# Altium schematic sheet Microcontroller.SchDoc
size A3; SheetNumber: 1; SheetTotal: 2
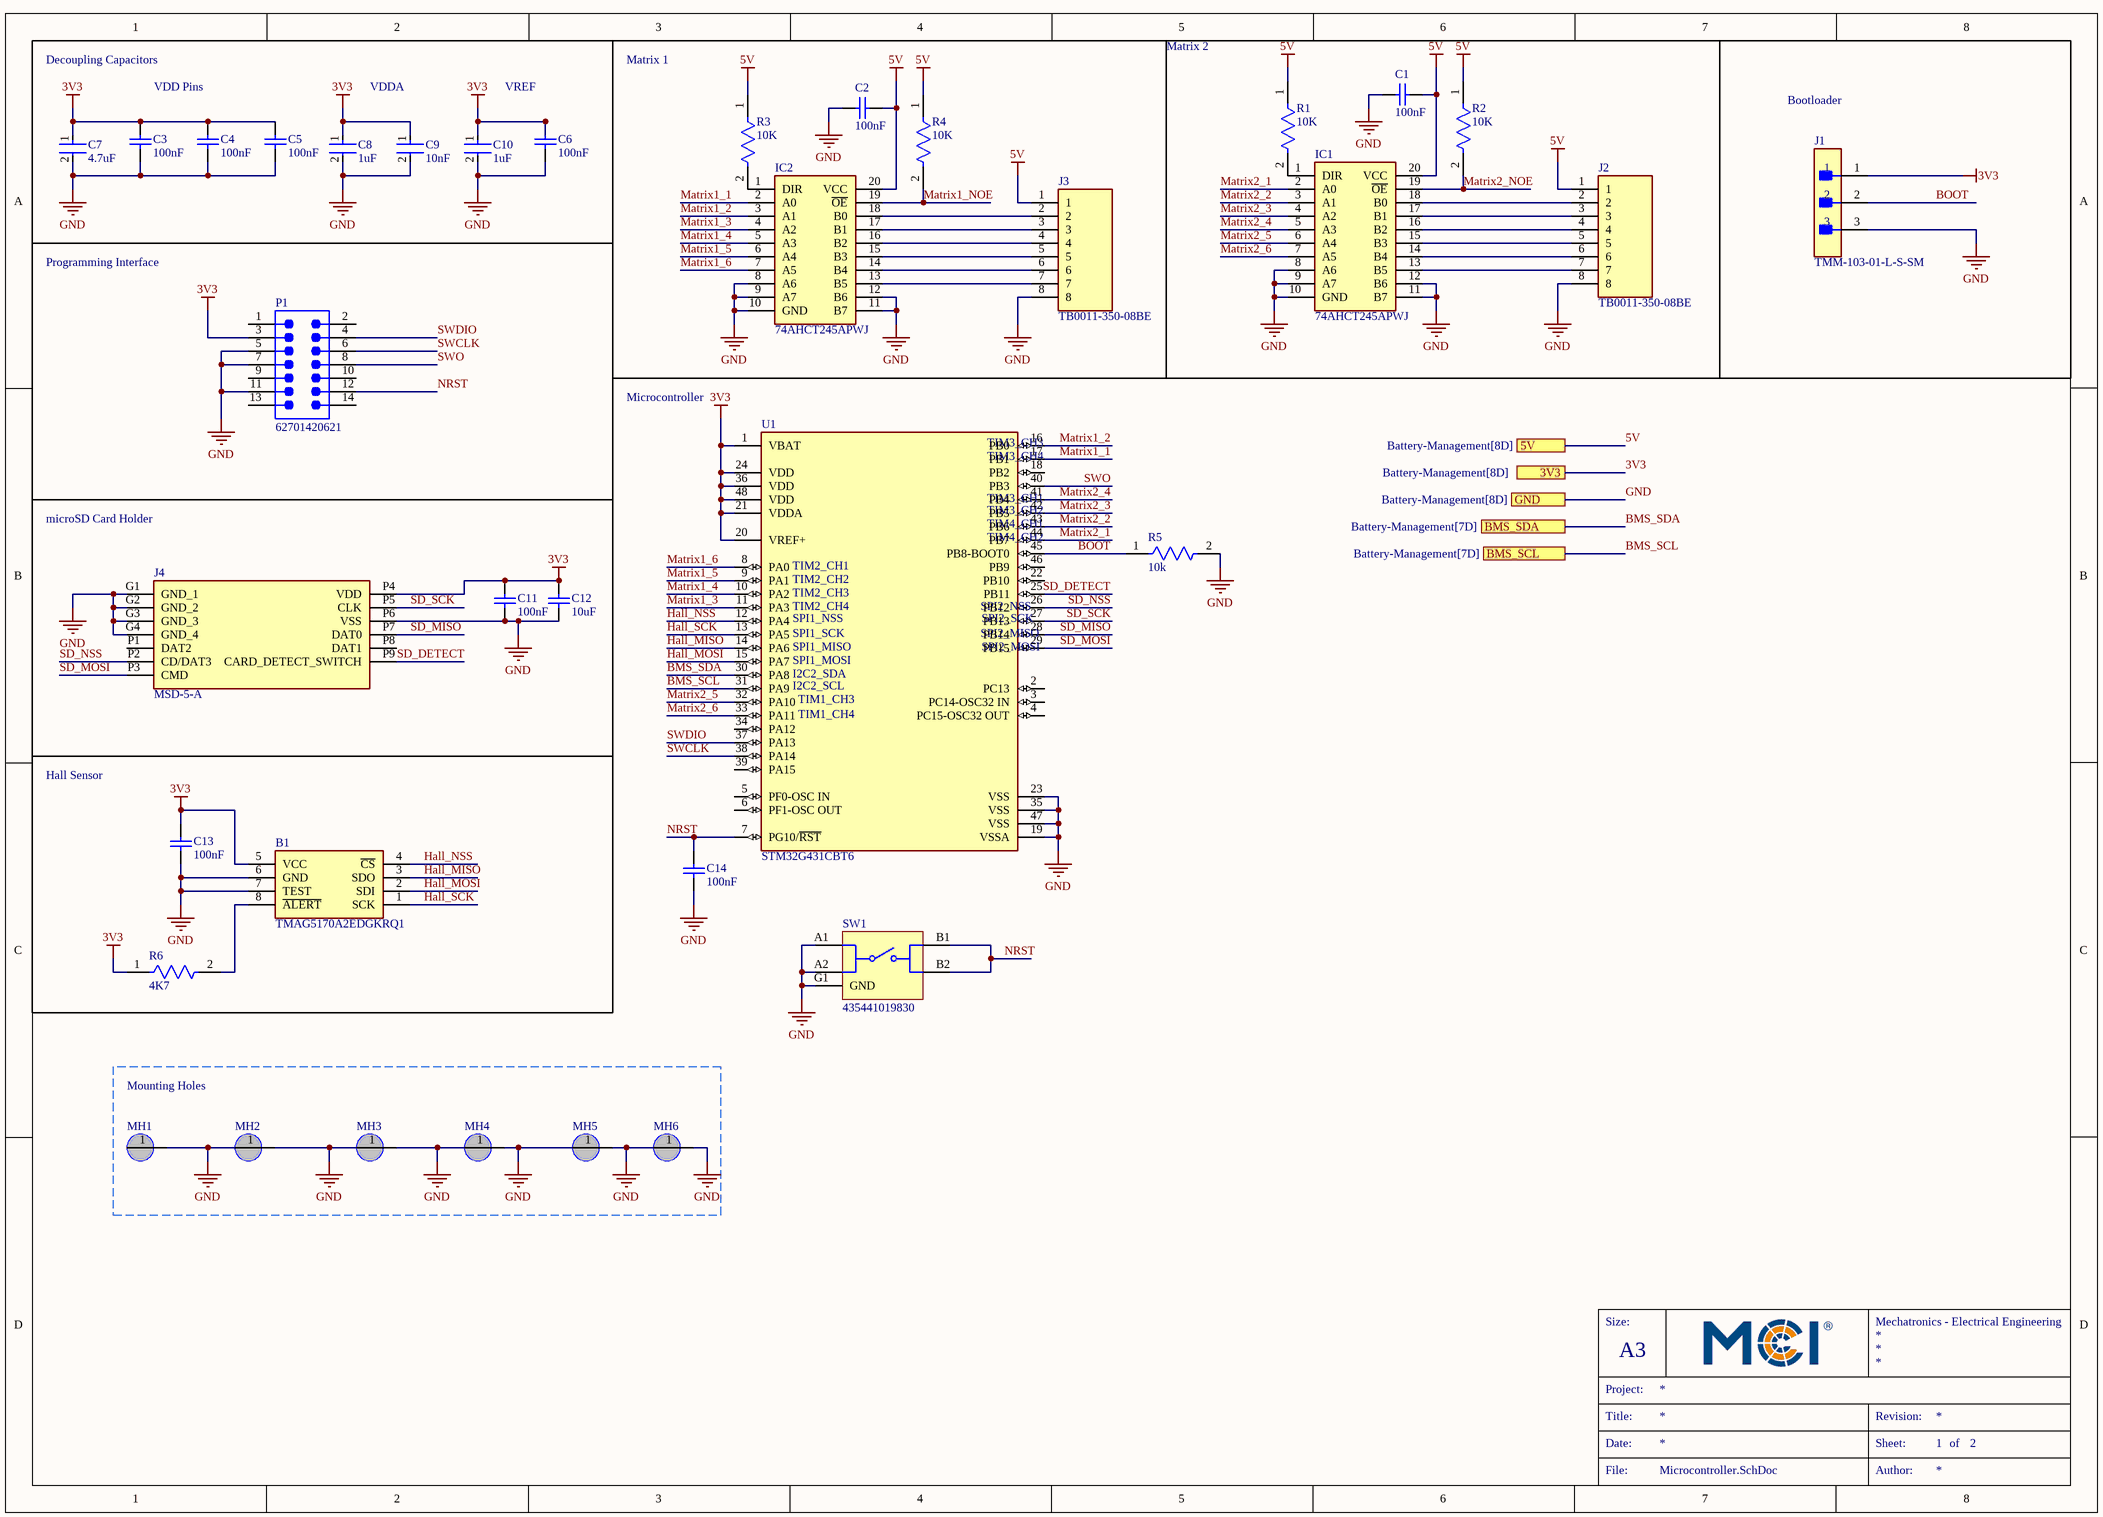
[diagram p0: Microcontroller.SchDoc]

## Parts
B1  TMAG5170A2EDGKRQ1  [SOP65P490X110-8N]
C1  100nF  [CAPC2013X145X50LL20T20]
C2  100nF  [CAPC2013X145X50LL20T20]
C3  100nF  [CAPC2013X145X50LL20T20]
C4  100nF  [CAPC2013X145X50LL20T20]
C5  100nF  [CAPC2013X145X50LL20T20]
C6  100nF  [CAPC2013X145X50LL20T20]
C7  4.7uF  [FP-C0805C475K3RACAUTO-MFG]
C8  1uF  [FP-CC0805-EB-MFG]
C9  10nF  [FP-AC0805-0_85-MFG]
C10  1uF  [FP-CC0805-EB-MFG]
C11  100nF  [CAPC2013X145X50LL20T20]
C12  10uF  [CAPC2013X140X50ML20T25]
C13  100nF  [CAPC2013X145X50LL20T20]
C14  100nF  [CAPC2013X145X50LL20T20]
IC1  74AHCT245APWJ  [SOP65P640X110-20N]
IC2  74AHCT245APWJ  [SOP65P640X110-20N]
J1  TMM-103-01-L-S-SM  [FP-TMM-103-01-L-S-SM-MFG]
J2  TB0011-350-08BE  [TB0011-350-08BE]
J3  TB0011-350-08BE  [TB0011-350-08BE]
J4  MSD-5-A  [MSD5A]
MH1  MountingHole  [MTH]  (value not drawn)
MH2  MountingHole  [MTH]  (value not drawn)
MH3  MountingHole  [MTH]  (value not drawn)
MH4  MountingHole  [MTH]  (value not drawn)
MH5  MountingHole  [MTH]  (value not drawn)
MH6  MountingHole  [MTH]  (value not drawn)
P1  62701420621  [62701420621]
R1  10K  [FP-AT0805-MFG]
R2  10K  [FP-AT0805-MFG]
R3  10K  [FP-AT0805-MFG]
R4  10K  [FP-AT0805-MFG]
R5  10k  [FP-AT0805-MFG]
R6  4K7  [FP-RT0805-MFG]
SW1  435441019830  [435441019830]
U1  STM32G431CBT6  [FP-LQFP48-5B-MFG]

## Blocks framed on the sheet
Matrix 1: C2 IC2 J3 R3 R4
Matrix 2: C1 IC1 J2 R1 R2
Mounting Holes: MH1-MH6

## Ports
3V3 (see Battery-Management[8D]), 5V (see Battery-Management[8D]), BMS_SCL (see Battery-Management[7D]), BMS_SDA (see Battery-Management[7D]), GND (see Battery-Management[8D])

## Nets
3V3: B1.5(VCC) C3.2 C4.2 C5.2 C6.2 C7.1 C8.1 C9.1 C10.1 C11.1 C12.2 C13.2 J1.1 J4.P4(VDD) P1.3 R6.1 U1.1(VBAT) U1.20(VREF+) U1.21(VDDA) U1.24(VDD) U1.36(VDD) U1.48(VDD) ; port 3V3
5V: C1.2 C2.2 IC1.20(VCC) IC2.20(VCC) J2.1 J3.1 R1.1 R2.1 R3.1 R4.1 ; port 5V
GND: B1.6(GND) B1.7(TEST) C1.1 C2.1 C3.1 C4.1 C5.1 C6.1 C7.2 C8.2 C9.2 C10.2 C11.2 C12.1 C13.1 C14.1 IC1.8(A6) IC1.9(A7) IC1.10(GND) IC1.11(B7) IC1.12(B6) IC2.8(A6) IC2.9(A7) IC2.10(GND) IC2.11(B7) IC2.12(B6) J1.3 J2.8 J3.8 J4.G1(GND_1) J4.G2(GND_2) J4.G3(GND_3) J4.G4(GND_4) J4.P6(VSS) MH1.1 MH2.1 MH3.1 MH4.1 MH5.1 MH6.1 P1.5 P1.7 P1.11 R5.2 SW1.A1 SW1.A2 SW1.G1(GND) U1.19(VSSA) U1.23(VSS) U1.35(VSS) U1.47(VSS) ; port GND
BMS_SCL: U1.31(PA9) ; port BMS_SCL
BMS_SDA: U1.30(PA8) ; port BMS_SDA
BOOT: J1.2 R5.1 U1.45(PB8-BOOT0)
Hall_MISO: B1.3(SDO) U1.14(PA6)
Hall_MOSI: B1.2(SDI) U1.15(PA7)
Hall_NSS: B1.4(~{CS}) U1.12(PA4)
Hall_SCK: B1.1(SCK) U1.13(PA5)
Matrix1_1: IC2.2(A0) U1.17(PB1)
Matrix1_2: IC2.3(A1) U1.16(PB0)
Matrix1_3: IC2.4(A2) U1.11(PA3)
Matrix1_4: IC2.5(A3) U1.10(PA2)
Matrix1_5: IC2.6(A4) U1.9(PA1)
Matrix1_6: IC2.7(A5) U1.8(PA0)
Matrix1_NOE: IC2.19(~{OE}) R4.2
Matrix2_1: IC1.2(A0) U1.44(PB7)
Matrix2_2: IC1.3(A1) U1.43(PB6)
Matrix2_3: IC1.4(A2) U1.42(PB5)
Matrix2_4: IC1.5(A3) U1.41(PB4)
Matrix2_5: IC1.6(A4) U1.32(PA10)
Matrix2_6: IC1.7(A5) U1.33(PA11)
Matrix2_NOE: IC1.19(~{OE}) R2.2
NRST: C14.2 P1.12 SW1.B1 SW1.B2 U1.7(PG10/~{RST})
SD_DETECT: J4.P9(CARD_DETECT_SWITCH) U1.25(PB11)
SD_MISO: J4.P7(DAT0) U1.28(PB14)
SD_MOSI: J4.P3(CMD) U1.29(PB15)
SD_NSS: J4.P2(CD/DAT3) U1.26(PB12)
SD_SCK: J4.P5(CLK) U1.27(PB13)
SWCLK: P1.6 U1.38(PA14)
SWDIO: P1.4 U1.37(PA13)
SWO: P1.8 U1.40(PB3)
NetB1_8: B1.8(~{ALERT}) R6.2
NetIC1_1: IC1.1(DIR) R1.2
NetIC1_13: IC1.13(B5) J2.7
NetIC1_14: IC1.14(B4) J2.6
NetIC1_15: IC1.15(B3) J2.5
NetIC1_16: IC1.16(B2) J2.4
NetIC1_17: IC1.17(B1) J2.3
NetIC1_18: IC1.18(B0) J2.2
NetIC2_1: IC2.1(DIR) R3.2
NetIC2_13: IC2.13(B5) J3.7
NetIC2_14: IC2.14(B4) J3.6
NetIC2_15: IC2.15(B3) J3.5
NetIC2_16: IC2.16(B2) J3.4
NetIC2_17: IC2.17(B1) J3.3
NetIC2_18: IC2.18(B0) J3.2

Not connected (* = marked no-connect by the designer): J4 P1(DAT2) P8(DAT1); P1 1 2 9 10 13 14; U1 2(PC13) 3(PC14-OSC32_IN) 4(PC15-OSC32_OUT) 5(PF0-OSC_IN) 6(PF1-OSC_OUT) 18(PB2) 22(PB10) 34(PA12) 39(PA15) 46(PB9)

## Notes on the sheet
- Decoupling Capacitors
- VDD Pins
- VDDA
- VREF
- Bootloader
- Programming Interface
- Microcontroller
- (near U1) TIM3_CH3
- (near U1) TIM3_CH4
- microSD Card Holder
- (near U1) TIM3_CH1
- (near U1) TIM3_CH2
- (near U1) TIM4_CH1
- (near U1) TIM2_CH3
- (near U1) TIM2_CH2
- (near U1) TIM2_CH1
- (near U1) TIM4_CH2
- (near U1) TIM2_CH4
- (near U1) SPI1_NSS
- (near U1) SPI1_SCK
- (near U1) SPI1_MISO
- (near U1) SPI2_NSS
- (near U1) SPI2_MISO
- (near U1) SPI2_SCK
- (near U1) SPI2_MOSI
- (near U1) SPI1_MOSI
- (near U1) I2C2_SDA
- (near U1) I2C2_SCL
- (near U1) TIM1_CH3
- (near U1) TIM1_CH4
- Hall Sensor
- Size:
- Mechatronics - Electrical Engineering
- Project:
- A3
- Title:
- Date:
- Revision:
- Sheet:
- of
- File:
- Author:

## Library data of the parts
B1 = TMAG5170A2EDGKRQ1: Board Mount Hall Effect/Magnetic Sensors; Manufacturer_Name: Texas Instruments; Geometry.Height: 1.1mm; Mouser Part Number: 595-MAG5170A2EDGKRQ1; Mouser Price/Stock: https://www.mouser.co.uk/ProductDetail/Texas-Instruments/TMAG5170A2EDGKRQ1?qs=doiCPypUmgFsK4QjDrwHCw%3D%3D; Manufacturer_Part_Number: TMAG5170A2EDGKRQ1; Datasheet Link: https://www.ti.com/lit/gpn/tmag5170-q1
C1-C6 C11 C13 C14 = CMP-2007-01396-1: Part Number: VJ0805Y104JXXPW1BC; Manufacturer: Vitramon
C7 = CMP-03020-034682-1: CAP CER 0805 4.7UF 25V X7R  10%; RoHS Compliant: Yes
C8 C10 = CMP-03422-000665-2: CAP CER 1UF 6.3V X7R 0805; Tolerance: 10%; Capacitance: 1uF; Weight: 0.000194oz; Width: 0.049inch; Thickness: 0.057inch; Dielectric: X7R; Termination: SMD/SMT; Packaging: Tape and Reel; RoHS Compliant: Yes; Length: 2mm; Halogen Free: Halogen Free; Voltage Rating: 6.3V; Height: 1.25mm; Max Operating Temperature: 125°C; Depth: 1.25mm; Construction: Flat; Case Code (Metric): 2012; Series: CC; Case/Package: 0805; Resistor Type: Ceramic; Case Code (Imperial): 0805; Min Operating Temperature: -55°C; Voltage Rating (DC): 6.3V; Lead Free: Lead Free; Mount: Surface Mount; Radiation Hardening: No
C9 = CMP-03422-000545-1: AC Series 0805 10 nF 100 V ±10% X7R Multilayer Ceramic Capacitor; Manufacturer: Yageo; Manufacturer Part Number: AC0805KRX7R0BB103; Temperature Coefficient: 15%; Automotive Grade: Grade 1; Tolerance: 0.1; Voltage Rating: 100 V; Capacitance: 10 nF; Lead Free: Yes; RoHS: TRUE; Temperature Range Low: -55°C; ComponentLink2URL: http://www.yageo.com/documents/recent/UPY-AC_NP0X7R_16V-to-630V_12.pdf; Ipc Land Pattern Name: CAPC200125X85; Footprint Url: http://www.yageo.com/exep/pages/download/literatures/UPY-C_GEN_24.pdf; Octopart: https://octopart.com/ac0805krx7r0bb103-yageo-75656636; Temperature Characteristic: X7R; Value: 10 nF; Device Class L2: Capacitors; Package: AC0805-0.85; Device Class L1: Passive Components; Category: Cap; Temperature: -55°C to +125°C; ComponentLink2Description: Datasheet; Mouser Description: AC Series 0805 10 nF 100 V ±10% X7R Multilayer Ceramic Capacitor; Automotive: Yes; Digikey Description: AC Series 0805 10 nF 100 V ±10% X7R Multilayer Ceramic Capacitor; Device Class L3: Ceramic Capacitors; Material: Ceramic; Temperature Range High: +125°C; Height: 0.95mm
C12 = CMP-2007-04702-1: Manufacturer: AVX Interconnect / Elco; Part Number: 0805ZC106KAT2A
IC1 IC2 = 74AHCT245APWJ: Integrated Circuit; Manufacturer_Name: Nexperia; Datasheet Link: https://assets.nexperia.com/documents/data-sheet/74AHCT245A.pdf; Height: 1.1mm; Manufacturer_Part_Number: 74AHCT245APWJ; Mouser Part Number: 771-74AHCT245APWJ; Mouser Price/Stock: https://www.mouser.co.uk/ProductDetail/Nexperia/74AHCT245APWJ?qs=u4fy%2FsgLU9Nfcswc3zVmFw%3D%3D; Arrow Part Number: 74AHCT245APWJ; Arrow Price/Stock: https://www.arrow.com/en/products/74ahct245apwj/nexperia
J1 = CMP-02766-001735-1: CONN HEADER SMD 3POS 2MM; Number of Positions: 3; Max Current Rating: 3.9A; Gender: Male; Max Voltage Rating (AC): 500V; Packaging: Bulk; Housing Color: Black; Connector Type: Header; Min Operating Temperature: -55°C; Contact Plating: Gold; Radiation Hardening: No; Insulation Color: Black; Housing Material: Polymer; Contact Shape: Square; Max Operating Temperature: 125°C; Fastening Type: Pull; Termination: Solder; Depth: 1.97mm; Series: TMM; Number of Contacts: 3; Contact Material: Bronze; RoHS Compliant: Yes; REACH SVHC: No SVHC; Contact Type: Male Pin; Pitch: 2mm; Insulation Material: Polymer; Lead Free: Lead Free; Orientation: Straight; Flammability Rating: UL94 V-0; Length: 6mm; Number of Rows: 1; Contact Finish - Mating: GOLD
J2 J3 = TB0011-350-08BE: Connector; Manufacturer_Name: Same Sky; Datasheet Link: https://www.sameskydevices.com/product/resource/tb0011-350.pdf; Height: 8.5mm; Manufacturer_Part_Number: TB0011-350-08BE
J4 = MSD-5-A: Connector; Manufacturer_Name: Same Sky; Datasheet Link: https://www.sameskydevices.com/product/resource/msd-5-a.pdf; Height: 2.15mm; Manufacturer_Part_Number: MSD-5-A; Mouser Part Number: 179-MSD-5-A; Mouser Price/Stock: https://www.mouser.co.uk/ProductDetail/Same-Sky/MSD-5-A?qs=Z%252BL2brAPG1IFv3XQ8lubzw%3D%3D; Arrow Part Number: MSD-5-A; Arrow Price/Stock: https://www.arrow.com/en/products/msd-5-a/cui-devices?utm_currency=USD&region=nac
P1 = CMP-03913-133967346-2: Conn, Hdr, 14Pos, 2Row, 1.27Mm, Smt Rohs Compliant: Yes; Current Rating: 1A; Insulation Resistance: 1GΩ; Max Operating Temperature: 105°C; Min Operating Temperature: -40°C; Number of Pins: 14; RoHS: Compliant; Pitch: 1.27mm; Length: 13.64mm
R1-R5 = CMP-03412-049031-1: Thin Film Chip Resistors Automotive Grade 10kΩ 0.5% 50ppm/°C 0805; Max Power Dissipation: 125mW; Resistance: 10kR; Ratings: AEC-Q200; Length: 0.079inch; Temperature Coefficient: 50ppm/°C; Height: 0.024inch; Min Operating Temperature: -55°C; Case/Package: 0805; Tolerance: 0.5%; RoHS Compliant: Yes; Features: Moisture Resistant; Number of Terminations: 2; Max Operating Temperature: 155°C; Series: AT; Packaging: Tape and Reel; Width: 0.049inch; Resistor Type: Thin Film
R6 = CMP-03412-028312-1: RES SMD 47K OHM 1% 1/8W 0805; Manufacturer Part Number: RT0805FRD0747KL; Manufacturer: Yageo; Resistance: 47KΩ; Voltage Rating: 150V; Power Rating: 0.125W; Tolerance: 0.0001; Temperature Coefficient: 25 ppm/°C; Value: 47KΩ; Footprint Url: http://www.yageo.com/exep/pages/download/literatures/PYu-R_Mount_10.pdf; Series: RT; Ipc Land Pattern Name: RESC200125X50; Device Class L3: Chip SMD Resistors; Digikey Description: RES SMD 47K OHM 1% 1/8W 0805; ComponentLink2URL: http://www.yageo.com/documents/recent/PYu-RT_1-to-0.01_RoHS_L_9.pdf; Octopart: https://octopart.com/rt0805frd0747kl-yageo-71400071; Device Class L2: Resistors; Temperature Range Low: -55°C; Composition: Thin Film; RoHS: TRUE; Automotive: No; ComponentLink2Description: Datasheet; Package: RT0805; Temperature Range High: +155°C; Lead Free: Yes; Category: Res; Temperature: -55°C to +155°C; Device Class L1: Passive Components; Height: 0.6mm
SW1 = CMP-03913-134708203-4: Tactile Switch, 0.05A, 32Vdc, Smd, 300Gf Rohs Compliant: Yes; Manufacturer Lifecycle Status: ACTIVE; YEOL: 1 = Estimated lifetime > 10 years; Insulation Resistance: 1GΩ; Voltage Rating: 32V; Current Rating: 50mA; Lifecycle Status: Production; RoHS: Compliant; Min Operating Temperature: -55°C; Height: 1.9mm; Packaging: Tape and Reel; Contact Plating: Silver; Max Operating Temperature: 125°C
U1 = CMP-12105-000030-1: MAINSTREAM ARM CORTEX-M4+ MCU 17; Manufacturer: STMicroelectronics; Number Of Adc Channels: 17; Number Of I/Os: 38; Standoff Height: 0.05mm; Number Of Usb Channels: 1; Data Bus Width: 32bits; Number Of I2C Channels: 3; Number Of Pwm Channels: 31; Frequency: 170MHz; Memory Type: FLASH; Number Of Timers/Counters: 14; Ram Size: 32KBytes; Max Junction Temp: +105°C; Memory Size: 128KBytes; Min Supply Voltage: 1.62V; Max Supply Voltage: 3.6V; Number Of Uart Channels: 4; Interface: I2C,SPI,UART,USART,CAN,USB,LIN,IrDA,I2S; Temperature Range Low: -40°C; Lead Free: Yes; Device Class L3: Microcontrollers; Number Of Cores: 1; Temperature Range High: +85°C; Height: 1.6mm; Digikey Description: MAINSTREAM ARM CORTEX-M4+ MCU 17; Device Class L1: Integrated Circuits (ICs); Package: LQFP48-5B; RoHS: TRUE; Number Of A/D Converters: 1; Core Architecture: Arm Cortex-M4; Device Class L2: Embedded Processors and Controllers; ComponentLink2Description: Datasheet; Temperature: -40°C to +85°C; Ambient Temperature Range High: +85°C; Ambient Temperature Range Low: -40°C; Octopart: https://octopart.com/stm32g431cbt6-stmicroelectronics-98835224; ComponentLink2URL: https://www.st.com/resource/en/datasheet/stm32g431cb.pdf; Automotive: No; Number Of Spi Channels: 3; Manufacturer Part Number: STM32G431CBT6; Category: IC